# Altium schematic sheet fonte.SchDoc
size A4
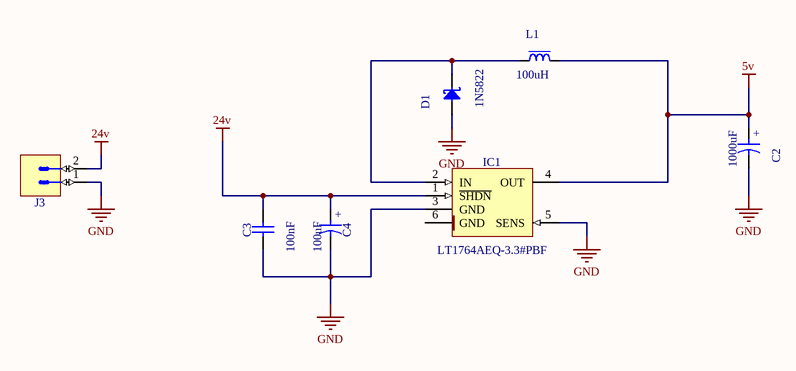
[diagram p0: fonte.SchDoc]

## Parts
C2  1000uF  [CAPPR500-1350X2200]
C3  100nF  [CAPC2012X135N]
C4  100uF  [CAPPR500-1050X1750]
D1  1N5822  [DO-201AD]
IC1  LT1764AEQ-3.3#PBF  [TO170P1394X457-6N-R900X1060]
J3  (no value)  [PHOENIX_1757242]
L1  100uH  [IND_WURTH_WE-PD4_L]

## Nets
5v: C2.1 IC1.4(OUT) L1.2
24v: C3.2 C4.1 IC1.1(~{SHDN}) J3.2
GND: C2.2 C3.1 C4.2 D1.2(A) IC1.3(GND) IC1.5(SENS) J3.1
NetD1_1: D1.1(C) IC1.2(IN) L1.1

Not connected (* = marked no-connect by the designer): IC1 6(GND)

## Notes on the sheet
- (in symbol CAER_100UF_63V_20%_500-1050X1750_LESR0R190) +
- (in symbol CAER_1000UF_35V_20%_VISHAY_MAL203850102E3) +

## Library data of the parts
C2 = CAER_1000UF_35V_20%_VISHAY_MAL203850102E3: Polarised capacitor; Part Description: Radial Standard Ultra Miniature Aluminum Electrolytic Capacitor (038 RSU Series); Manufacturer: VISHAY BCCOMPONENTS; Voltage: 35V; Tolerance: ±20%; Table: Capacitors THD; Part Number: CAER_1000UF_35V_20%_VISHAY_MAL203850102E3; Component Kind: Standard; Component Type: Standard; Pin Count: 2; Value: 1000uF; Status: None; Manufacturer Part Number: MAL203850102E3; Case: LS5 D13.5 x H22; Mounted: Yes; Socket: No; SMD: No; ComponentHeight: 22mm; HelpURL: \\cern.ch\dfs\Applications\Altium\Datasheets\CAER_VISHAY_038 RSU.pdf; Author: CERN DEM JLC; CreateDate: 11/04/2012; LatestRevisionDate: 11/04/2012
C3 = CC0805_100NF_50V_10%_X7R: Non-polarised capacitor; Part Description: SMD Multilayer Chip Ceramic Capacitor; Manufacturer: GENERIC; Manufacturer1 Part Number: B37941K5104K62; Voltage: 50V; TC: X7R; Tolerance: ±10%; Table: Capacitors SMD; Part Number: CC0805_100NF_50V_10%_X7R; Component Kind: Standard; Component Type: Standard; Pin Count: 2; Value: 100nF; Status: Preferred; Manufacturer Part Number: CC0805_100NF_50V_10%_X7R; Case: 0805; Mounted: Yes; Socket: No; SMD: Yes; Manufacturer1 Example: EPCOS; Manufacturer1 ComponentHeight: 1.35mm; HelpURL: \\cern.ch\dfs\Applications\Altium\Datasheets\CC0805_X7R_EPCOS.pdf; Author: CERN DEM JLC; CreateDate: 03/12/2007; LatestRevisionDate: 03/12/2007
C4 = CAER_100UF_63V_20%_500-1050X1750_LESR0R190: Polarised capacitor; Part Description: Low ESR 0R190 Aluminum Electrolytic Capacitor; Manufacturer: VISHAY BCCOMPONENTS; Manufacturer Part Number: MAL213668101E3 Series 136RVI; Voltage: 63V; Tolerance: ±20%; Table: Capacitors THD; Part Number: CAER_100UF_63V_20%_500-1050X1750_LESR0R190; Component Kind: Standard; Component Type: Standard; Pin Count: 2; Value: 100uF; Status: Preferred; Case: LS5 D10.5 x H17.5; Mounted: Yes; Socket: No; SMD: No; ComponentHeight: 17.5mm; HelpURL: \\cern.ch\dfs\Applications\Altium\Datasheets\CAER-LESR_VISHAY_136RVI.pdf; Author: CERN DEM JLC; CreateDate: 03/07/2008; LatestRevisionDate: 16/03/2009
D1 = 1N5822: Schottky Diode; Part Description: Schottky Rectifier; Manufacturer: FAIRCHILD SEMICONDUCTOR; Voltage: 40V; Power: 3A; Table: Diodes; Part Number: 1N5822; Component Kind: Standard; Component Type: Standard; Device: 1N5822; PackageDescription: DO-201AD, Diode, Axial; Lead Spacing 20.32mm, Lead Dia. 1.3mm, Body Length 9.5mm, Body Dia. 5.6mm; Manufacturer Part Number: 1N5822; Pin Count: 2; Case: DO-201AD; Mounted: Yes; Socket: No; SMD: No; ComponentHeight: 5.6mm; HelpURL: \\cern.ch\dfs\Applications\Altium\Datasheets\1N5822.pdf; Author: CERN DEM JLC; CreateDate: 31/03/2009; LatestRevisionDate: 31/03/2009
IC1 = LT1764AEQ-3.3#PBF: 3A, Fast Transient Response, Low Noise, LDO Regulators; Manufacturer: LINEAR TECHNOLOGY; Part Number: LT1764AEQ-3.3#PBF; Component Kind: Standard; Component Type: Standard; Device: LT1764AEQ-3.3#PBF; PackageDescription: TO, 1.70mm Pitch; 5 Pin, 13.945mm L X 8.89mm W X 4.572mm H body, IPC Medium Density; Part Description: 3A, Fast Transient Response, Low Noise, LDO Regulators; Manufacturer Part Number: LT1764AEQ-3.3#PBF; Pin Count: 6; Case: TO-263; Mounted: Yes; Socket: No; SMD: Yes; ComponentHeight: 4.57mm; HelpURL: \\cern.ch\dfs\Applications\Altium\Datasheets\LT1764AEQ-3.3#PBF.pdf; Author: CERN DEM JLC; CreateDate: 27/03/2012; LatestRevisionDate: 27/03/2012; Table: Regulators
J3 = PHOENIX_1757242: Connector 2 Male; Part Description: 12A, 250V, Pitch 5.08mm, 2 Positions Header; Manufacturer: PHOENIX CONTACT; Manufacturer Part Number: 1757242 (MSTBA 2,5/ 2-G-5,08); Part Number: PHOENIX_1757242; Component Kind: Standard; Component Type: Standard; Pin Count: 2; Mounted: Yes; Socket: No; SMD: No; Status: None; ComponentHeight: 8.6mm; HelpURL: \\cern.ch\dfs\Applications\Altium\Datasheets\PHOENIX_1757242.pdf; Author: CERN DEM JLC; CreateDate: 10/02/2010; LatestRevisionDate: 26/04/2010; Table: PHOENIX
L1 = IND_3.3UH_20%_WURTH_WE-PD4_74456033: Inductor With Magnetic core; Part Description: Power Choke (WE-PD 4 Serie); Manufacturer: WURTH ELEKTRONIK; Value: 3.3uH; Power: 5.3A; Resistance: 0.015R; Tolerance: ±20%; Table: Inductors SMD; Part Number: IND_3.3UH_20%_WURTH_WE-PD4_74456033; Component Kind: Standard; Component Type: Standard; Pin Count: 2; Status: None; Manufacturer Part Number: 74456033; Mounted: Yes; Socket: No; SMD: Yes; ComponentHeight: 5.3mm; HelpURL: \\cern.ch\dfs\Applications\Altium\Datasheets\IND_WURTH_WE-PD4_74456033.pdf; Author: CERN DEM JLC; CreateDate: 07/06/2011; LatestRevisionDate: 24/01/2012